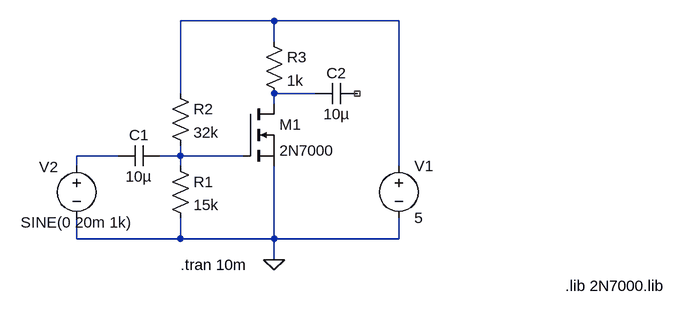
[diagram p0: schematic 2N7000_3.asc]
2N7000_3.asc, the LTspice schematic file:
Version 4
SHEET 1 880 680
WIRE 208 16 64 16
WIRE 400 16 208 16
WIRE 208 48 208 16
WIRE 64 128 64 16
WIRE 272 128 208 128
WIRE 208 144 208 128
WIRE -32 224 -96 224
WIRE 64 224 64 208
WIRE 64 224 32 224
WIRE 160 224 64 224
WIRE -96 240 -96 224
WIRE 64 240 64 224
WIRE 400 240 400 16
WIRE -96 352 -96 320
WIRE 64 352 64 320
WIRE 64 352 -96 352
WIRE 208 352 208 240
WIRE 208 352 64 352
WIRE 400 352 400 320
WIRE 400 352 208 352
WIRE 208 384 208 352
FLAG 208 384 0
SYMBOL nmos 160 144 R0
SYMATTR InstName M1
SYMATTR Value 2N7000
SYMATTR Prefix X
SYMBOL voltage 400 224 R0
WINDOW 123 0 0 Left 0
WINDOW 39 0 0 Left 0
SYMATTR InstName V1
SYMATTR Value 5
SYMBOL voltage -96 224 R0
WINDOW 123 0 0 Left 0
WINDOW 39 0 0 Left 0
WINDOW 0 -58 17 Left 2
WINDOW 3 -86 103 Left 2
SYMATTR InstName V2
SYMATTR Value SINE(0 20m 1k)
SYMBOL cap 32 208 R90
WINDOW 0 0 32 VBottom 2
WINDOW 3 32 32 VTop 2
SYMATTR InstName C1
SYMATTR Value 10µ
SYMBOL res 48 224 R0
SYMATTR InstName R1
SYMATTR Value 15k
SYMBOL res 48 112 R0
SYMATTR InstName R2
SYMATTR Value 32k
SYMBOL res 192 32 R0
SYMATTR InstName R3
SYMATTR Value 1k
SYMBOL cap 336 112 R90
WINDOW 0 0 32 VBottom 2
WINDOW 3 32 32 VTop 2
SYMATTR InstName C2
SYMATTR Value 10µ
TEXT 656 424 Left 2 !.lib 2N7000.lib
TEXT 64 392 Left 2 !.tran 10m

The netlist it stands for:
* 2N7000_3.asc
XM1 N002 N004 0 2N7000  ; pins D G S
V1 N001 0 5
V2 N003 0 SINE(0 20m 1k)
C1 N004 N003 10µ
R1 N004 0 15k
R2 N001 N004 32k
R3 N001 N002 1k
C2 NC_01 N002 10µ
.lib 2N7000.lib
.tran 10m
.backanno
.end